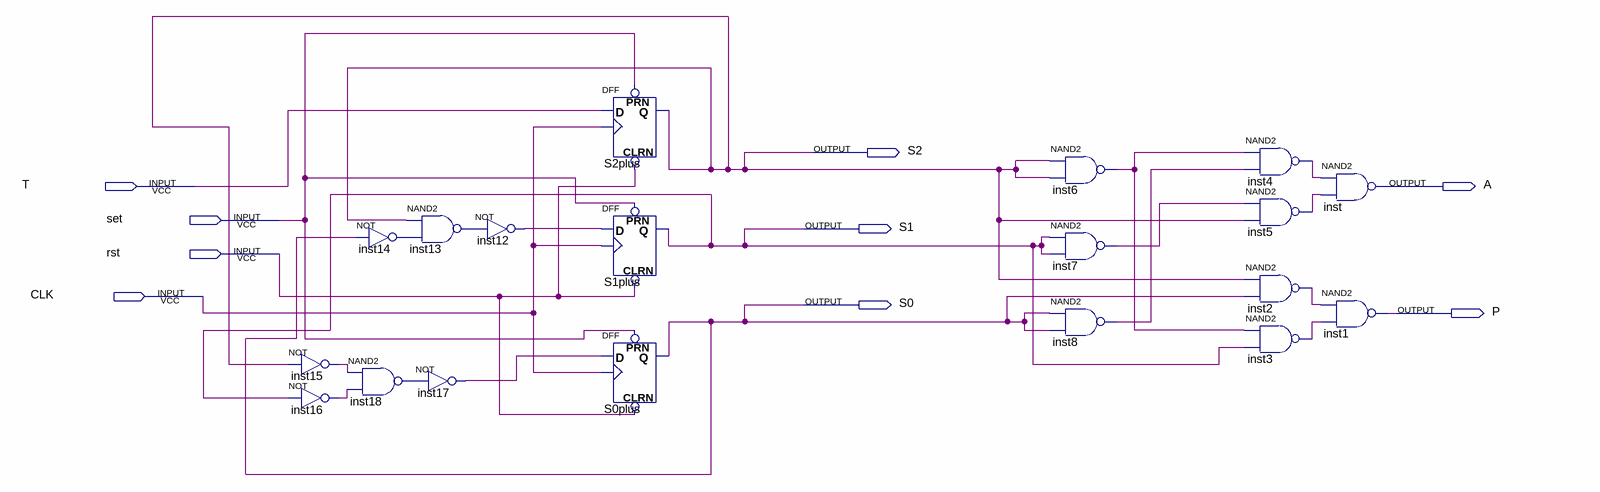
[diagram p0: schematic sheet]
// Quartus schematic lab7.bdf as structural Verilog: 19 symbols, 9 pins
module lab7 (
  input  T,
  input  set,
  input  rst,
  input  CLK,
  output S2,
  output A,
  output S1,
  output S0,
  output P
);

  wire inst2_out, inst3_out, inst4_out, inst5_out, inst6_out, inst7_out, inst8_out, inst12_out, inst13_out,
       inst14_out, inst15_out, inst16_out, inst17_out, inst18_out;

  not inst15 (inst15_out, S2);
  not inst16 (inst16_out, S1);
  not inst14 (inst14_out, S0);
  nand inst18 (inst18_out, inst15_out, inst16_out);
  nand inst13 (inst13_out, S2, inst14_out);
  not inst17 (inst17_out, inst18_out);
  not inst12 (inst12_out, inst13_out);
  DFF S2plus (.CLRN(rst), .CLK(CLK), .D(T), .PRN(set), .Q(S2));
  DFF S1plus (.CLRN(rst), .CLK(CLK), .D(inst12_out), .PRN(set), .Q(S1));
  DFF S0plus (.CLRN(rst), .CLK(CLK), .D(inst17_out), .PRN(set), .Q(S0));
  nand inst6 (inst6_out, S2, S2);
  nand inst7 (inst7_out, S1, S1);
  nand inst8 (inst8_out, S0, S0);
  nand inst4 (inst4_out, inst6_out, inst8_out);
  nand inst5 (inst5_out, inst7_out, S2);
  nand inst2 (inst2_out, S2, S0);
  nand inst3 (inst3_out, inst6_out, S1);
  nand inst (A, inst4_out, inst5_out);
  nand inst1 (P, inst2_out, inst3_out);
endmodule
